# Altium project Airframe-Sensors.PrjPcb
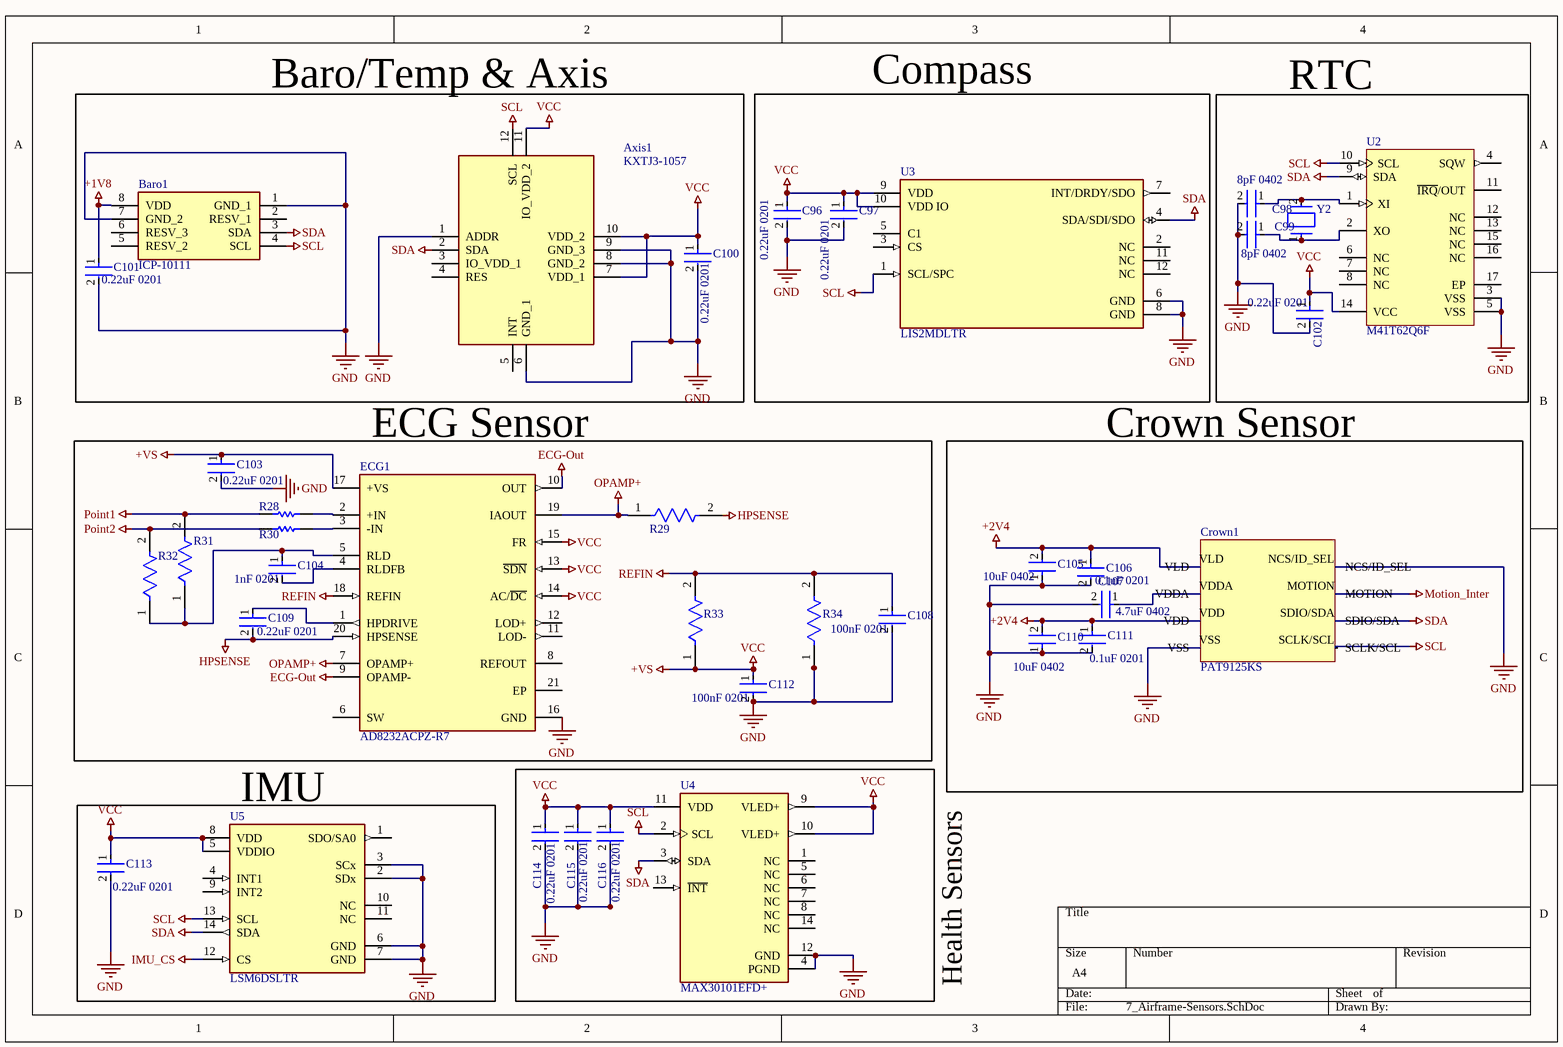
[diagram p0: 7_Airframe-Sensors.SchDoc]
1 sheet, 37 parts. Net scope: global (net labels, ports and power ports of the same name join across sheets).
Board file: Power_Test.PcbDoc

## Sheet 7_Airframe-Sensors.SchDoc
size A4; SheetNumber: 1; SheetTotal: 1

### Parts
Axis1  KXTJ3-1057  [2X2X0.9MMLGA]
Baro1  ICP-10111  [ICP10111]
C96  0.22uF 0201  [FP-C0603-030-0_03-IPC_C]
C97  0.22uF 0201  [FP-C0603-030-0_03-IPC_C]
C98  8pF 0402  [FP-C0402C225M9PACTU-MFG]
C99  8pF 0402  [FP-C0402C225M9PACTU-MFG]
C100  0.22uF 0201  [FP-C0603-030-0_03-IPC_C]
C101  0.22uF 0201  [FP-C0603-030-0_03-IPC_C]
C102  0.22uF 0201  [FP-C0603-030-0_03-IPC_C]
C103  0.22uF 0201  [FP-C0603-030-0_03-IPC_C]
C104  1nF 0201  [FP-C0603-030-0_03-IPC_C]
C105  10uF 0402  [FP-C0402C225M9PACTU-MFG]
C106  0.1uF 0201  [FP-C0603-030-0_03-IPC_C]
C107  4.7uF 0402  [FP-C0402C225M9PACTU-MFG]
C108  100nF 0201  [FP-C0603-030-0_03-IPC_C]
C109  0.22uF 0201  [FP-C0603-030-0_03-IPC_C]
C110  10uF 0402  [FP-C0402C225M9PACTU-MFG]
C111  0.1uF 0201  [FP-C0603-030-0_03-IPC_C]
C112  100nF 0201  [FP-C0603-030-0_03-IPC_C]
C113  0.22uF 0201  [FP-C0603-030-0_03-IPC_C]
C114  0.22uF 0201  [FP-C0603-030-0_03-IPC_C]
C115  0.22uF 0201  [FP-C0603-030-0_03-IPC_C]
C116  0.22uF 0201  [FP-C0603-030-0_03-IPC_C]
Crown1  PAT9125KS  [PAT9125KS-Footprint-1]
ECG1  AD8232ACPZ-R7  [FP-CP-20-8-IPC_C]
R28  RC0402FR-07180KL  [RESC1005X40X25ML05T10]  (value not drawn)
R29  CR0402-JW-105GLF  [FP-CR0402-MFG]  (value not drawn)
R30  RC0402FR-07180KL  [RESC1005X40X25ML05T10]  (value not drawn)
R31  CR0402-JW-105GLF  [FP-CR0402-MFG]  (value not drawn)
R32  CR0402-JW-105GLF  [FP-CR0402-MFG]  (value not drawn)
R33  CR0402-JW-105GLF  [FP-CR0402-MFG]  (value not drawn)
R34  CR0402-JW-105GLF  [FP-CR0402-MFG]  (value not drawn)
U2  M41T62Q6F  [STM-QFN-16_V]
U3  LIS2MDLTR  [FP-LGA-12-DM00170568-MFG]
U4  MAX30101EFD+  [FP-F143A5-1-MFG]
U5  LSM6DSLTR  [FP-LGA-14L-DM00249496-MFG]
Y2  ABS07-120-32.768KHZ-T  [FP-ABS07-120-MFG]  (value not drawn)

### Blocks framed on the sheet
ECG Sensor: C103 C104 C108 C109 C112 ECG1 R28-R34
Crown Sensor: C105-C107 C110 C111 Crown1
IMU: C113 U5

### Nets
+1V8: Baro1.8(VDD) C101.1
+2V4: C105.2 C106.1 C110.2 C111.1 Crown1.VDD Crown1.VLD
+VS: Axis1.7(VDD_1) Axis1.10(VDD_2) Axis1.11(IO_VDD_2) C96.1 C97.1 C100.1 C102.1 C103.1 C112.1 C113.1 C114.1 C115.1 C116.1 ECG1.13(~{SDN}) ECG1.14(AC/~{DC}) ECG1.15(FR) ECG1.17(+VS) R33.1 U2.14(VCC) U3.9(VDD) U3.10(VDD_IO) U4.9(VLED+) U4.10(VLED+) U4.11(VDD) U5.5(VDDIO) U5.8(VDD)  [also labelled VCC]
ECG-Out: ECG1.9(OPAMP-) ECG1.10(OUT)
GND: Axis1.1(ADDR) Axis1.6(GND_1) Axis1.8(GND_2) Axis1.9(GND_3) Baro1.1(GND_1) Baro1.7(GND_2) C96.2 C97.2 C98.2 C99.2 C100.2 C101.2 C102.2 C103.2 C105.1 C106.2 C107.2 C108.2 C110.1 C111.2 C112.2 C113.2 C114.2 C115.2 C116.2 Crown1.NCS/ID_SEL Crown1.VSS ECG1.16(GND) R34.1 U2.3(VSS) U2.5(VSS) U3.6(GND) U3.8(GND) U4.4(PGND) U4.12(GND) U5.2(SDx) U5.3(SCx) U5.6(GND) U5.7(GND)
HPSENSE: C109.2 ECG1.20(HPSENSE) R29.2
IMU_CS: U5.12(CS)
Motion_Inter: Crown1.MOTION
OPAMP+: ECG1.7(OPAMP+) ECG1.19(IAOUT) R29.1
Point1: R28.1 R31.2
Point2: R30.1 R32.2
REFIN: C108.1 ECG1.18(REFIN) R33.2 R34.2
SCL: Axis1.12(SCL) Baro1.4(SCL) Crown1.SCLK/SCL U2.10(SCL) U3.1(SCL/SPC) U4.2(SCL) U5.13(SCL)
SDA: Axis1.2(SDA) Baro1.3(SDA) Crown1.SDIO/SDA U2.9(SDA) U3.4(SDA/SDI/SDO) U4.3(SDA) U5.14(SDA)
NetC98_1: C98.1 U2.1(XI) Y2.2
NetC99_1: C99.1 U2.2(XO) Y2.1
NetC104_1: C104.1 ECG1.5(RLD) R31.1 R32.1
NetC104_2: C104.2 ECG1.4(RLDFB)
NetC107_1: C107.1 Crown1.VDDA
NetC109_1: C109.1 ECG1.1(HPDRIVE)
NetECG1_2: ECG1.2(+IN) R28.2
NetECG1_3: ECG1.3(-IN) R30.2

Not connected (* = marked no-connect by the designer): Axis1 3(IO_VDD_1) 4(RES) 5(INT); Baro1 2(RESV_1) 5(RESV_2) 6(RESV_3); ECG1 6(SW) 8(REFOUT) 11(LOD-) 12(LOD+) 21(EP); U2 4(SQW) 6(NC) 7(NC) 8(NC) 11(~{IRQ}/OUT) 12(NC) 13(NC) 15(NC) 16(NC) 17(EP); U3 2(NC) 3(CS) 5(C1) 7(INT/DRDY/SDO) 11(NC) 12(NC); U4 1(NC) 5(NC) 6(NC) 7(NC) 8(NC) 13(~{INT}) 14(NC); U5 1(SDO/SA0) 4(INT1) 9(INT2) 10(NC) 11(NC)

### Notes on the sheet
- Baro/Temp & Axis
- Compass
- RTC
- Health Sensors

### Library data of the parts
Axis1 = KXTJ3-1057: Accelerometer; Manufacturer_Name: Kionix; Datasheet Link: http://www.mouser.com/ds/2/348/KXTJ3-1057 Specifications Rev 2.0-1074602.pdf; Manufacturer_Part_Number: KXTJ3-1057; Mouser Part Number: 912-KXTJ3-1057; Mouser Price/Stock: https://www.mouser.co.uk/ProductDetail/Kionix/KXTJ3-1057?qs=hicmRmzGcNR8WipH%252BLEjqg%3D%3D
Baro1 = ICP-10111: Undefined or Miscellaneous; Manufacturer_Name: TDK; Datasheet Link: https://product.tdk.com/system/files/dam/doc/product/sensor/pressure/capacitive-pressure/data_sheet/ds-000186-icp-101xx.pdf; Height: 1mm; Manufacturer_Part_Number: ICP-10111; Mouser Part Number: 410-ICP-10111; Mouser Price/Stock: https://www.mouser.co.uk/ProductDetail/TDK-InvenSense/ICP-10111?qs=%252BEew9%252B0nqrBWGDChI3rokg%3D%3D; Arrow Part Number: ICP-10111; Arrow Price/Stock: https://www.arrow.com/en/products/icp-10111/invensense
C96 C97 C100-C104 C106 C108 C109 C111-C116 = CMP-08246-007095-1: Multilayer Ceramic Capacitors 220nF ±10% 6.3V X6S SMD 0201; Dielectric: X6S; Resistor Type: Ceramic; Length: 0.6mm; Capacitance: 220nF; Case Code (Metric): 0603; Series: C; Width: 0.012inch; Height: 0.3mm; Voltage Rating: 6.3V; Max Operating Temperature: 105°C; REACH SVHC: No SVHC; RoHS Compliant: Yes; Tolerance: 10%; Termination: SMD/SMT; Case/Package: 0201; Case Code (Imperial): 0201; Weight: 6E-06oz; Lead Free: Lead Free; Construction: Flat; Thickness: 300um; Mount: Surface Mount; Dielectric Material: Ceramic; Voltage Rating (DC): 6.3V; Packaging: Cut Tape; Package Quantity: 1; Min Operating Temperature: -55°C; Depth: 0.3mm
C98 C99 C105 C107 C110 = CMP-2008-02064-3: CAP CER 2.2UF 6.3V X5R 0402; Tolerance: 20%; Dissipation Factor: 5%; Dielectric Material: Ceramic; Lead Free: Lead Free; Depth: 0.5mm; Series: C; Termination: SMD/SMT; Case Code (Metric): 1005; Case/Package: 0402; Dielectric: X5R; RoHS Compliant: Yes; Thickness: 0.022inch; Voltage Rating: 6.3V; Voltage: 6.3V; Height: 0.5mm; Mount: Surface Mount; Construction: Flat; Case Code (Imperial): 0402; Min Operating Temperature: -55°C; Contact Plating: Tin; Radiation Hardening: No; Number of Pins: 2; Voltage Rating (DC): 6.3V; Capacitance: 2.2uF; Width: 0.5mm; Package Quantity: 1; Packaging: Tape and Reel; Max Operating Temperature: 85°C; Length: 1mm; REACH SVHC: No SVHC
Crown1 = CMP-00000-2
ECG1 = CMP-09085-000003-1: IC ECG FRONT END 20LFCSP; Input Offset Voltage (Vos): 3mV; Power Supply Rejection Ratio (PSRR): 90dB; Input Bias Current: 50pA; Nominal Supply Current: 170uA; Min Supply Voltage: 2V; Common Mode Rejection Ratio: 80dB; Max Supply Voltage: 3.5V; Contact Plating: Tin; Operating Supply Current: 170uA; Packaging: Tape and Reel; REACH SVHC: No SVHC; Case/Package: LFCSP EP; Number of Pins: 20; Lead Free: Contains Lead; Min Operating Temperature: -40°C; Package Quantity: 1500; Mount: Surface Mount; Max Operating Temperature: 85°C
R28 R30 = CMP-1011-00763-4: Chip Resistor, 180 KOhm, +/- 1%, 62.5 mW, -55 to 155 degC, 0402 (1005 Metric), RoHS, Tape and Reel; Manufacturer: Basic Passives; Power Rating: 62.5 mW; Voltage Rating: 50 V; Case\/Package: 0402; Length: 1 mm; RoHSCompliant: true; Mounting Technology: Surface Mount; Min Operating Temperature: -55 degC; PackageDescription: 2-Pin Surface Mount Device, Body 1 x 0.5 mm; Case Code (Imperial): 0402; Resistance: 180 KOhm; ComponentLink2URL: http://download.siliconexpert.com/pdfs/2016/1/13/0/45/27/830/yageo_/manual/8727809758379137pyu-rc_group_51_rohs_l___3.pdf; Packaging: Tape and Reel; Tolerance: 1%; Width: 0.5 mm; PackageReference: 0402; PartNumber: RC0402FR-07180KL; Max Operating Temperature: 155 degC; Package Quantity: 200; Height: 0.35 mm; Mount: Surface Mount; Pins: 2; DatasheetVersion: 12/2015; ComponentLink1URL: http://www.yageo.com/; ComponentLink1Description: Manufacturer URL; Case Code (Metric): 1005; REACH SVHC: No SVHC; ComponentLink2Description: Datasheet
R29 R31 R32 = CMP-2002-05525-2: Thick Film Chip Resistors 0402 1MΩ 0.0625W 5% 200ppm/°C; Voltage Rating: 50V; Max Power Dissipation: 63mW; Resistance: 1MR; Power Rating: 62.5mW; Case/Package: 0402; Depth: 0.5mm; Case Code (Imperial): 0402; Width: 0.02inch; Length: 1mm; Tolerance: 5%; Min Operating Temperature: -55°C; Number of Terminations: 2; Thickness: 356um; Case Code (Metric): 1005; Radiation Hardening: No; Height: 0.016inch; Military Standard: Not; Mount: Surface Mount; Termination: SMD/SMT; Composition: Thick Film; Temperature Coefficient: 200ppm/°C; Contact Plating: Tin; Packaging: Tape and Reel; Package Quantity: 10000; Max Operating Temperature: 125°C
R33 R34 = CMP-2002-05525-2: Thick Film Chip Resistors 0402 10MΩ 0.0625W 5% 200ppm/°C; Voltage Rating: 50V; Max Power Dissipation: 63mW; Resistance: 1MR; Power Rating: 62.5mW; Case/Package: 0402; Depth: 0.5mm; Case Code (Imperial): 0402; Width: 0.02inch; Length: 1mm; Tolerance: 5%; Min Operating Temperature: -55°C; Number of Terminations: 2; Thickness: 356um; Case Code (Metric): 1005; Radiation Hardening: No; Height: 0.016inch; Military Standard: Not; Mount: Surface Mount; Termination: SMD/SMT; Composition: Thick Film; Temperature Coefficient: 200ppm/°C; Contact Plating: Tin; Packaging: Tape and Reel; Package Quantity: 10000; Max Operating Temperature: 125°C
U2 = CMP-2000-06644-1: Low-Power Serial Real-Time Clock (RTC) with Alarm, 1.3 to 4.4 V, -40 to 85 degC, 16-Pin QFN, RoHS, Tape and Reel; Manufacturer: STMicroelectronics; Supply Voltage Max: 4.4V; Clock Frequency: 32.768kHz; Base Number: 41; No. of Outputs: 2; IC Interface Type: I2C,Serial; Memory Configuration: 16x8; Date Format: Day; RTC Features: Square-WaveOutput; Clock Format: HH:MM:SS; No. of Pins: 16; Supply Voltage Min: 1.3V; SVHC: NoSVHC(19-Dec-2012); Interface: Serial,I2C; Supply Voltage Range: 1.3Vto4.4V; Operating Temperature Min: -40°C; Type: RTC; Digital IC Case Style: QFN; Package Description: 16-Pin Quad Flat No-lead Package, Body 3 x 3 mm, Pitch 0.5 mm, Thermal Pad 1.8 x1.8 mm; Package Reference: QFN-16; Mounting Technology: SurfaceMount; Interface Type: I2C,Serial; Datasheet URL: http://www.st.com/content/ccc/resource/technical/document/datasheet/c8/66/38/71/c4/ac/49/9e/CD00019860.pdf/files/CD00019860.pdf/jcr:content/translations/en.CD00019860.pdf; Manufacturer URL: http://www.st.com/; Datasheet Version: Rev. 22, 10/2015; Clock IC Type: RTC; Termination Type: SMD; IC Case Style: QFN; Package / Case: QFN; Operating Temperature Range: -40°Cto+85°C; Operating Temperature Max: 85°C
U3 = CMP-12173-000002-1: SENSOR MR I2C/SPI 12LGA; Manufacturer: STMicroelectronics; Sensing Method: Magnetic; Min Supply Voltage: 1.71V; Sensor Output: I2C,SPI; Operating Supply Current: 50-200uA; Max Supply Voltage: 3.6V; Octopart: https://octopart.com/lis2mdltr-stmicroelectronics-81117311; RoHS: TRUE; Device Class L3: unset; Device Class L1: Sensors; ComponentLink2URL: https://www.st.com/resource/en/datasheet/lis2mdl.pdf; Automotive: No; Device Class L2: Magnetic Sensors; Lead Free: Yes; Temperature: -40°C to +85°C; Manufacturer Part Number: LIS2MDLTR; Temperature Range High: +85°C; Height: 0.7mm; Digikey Description: SENSOR MR I2C/SPI 12LGA; Category: IC; ComponentLink2Description: Datasheet; Package: LGA-12-DM00170568; Temperature Range Low: -40°C
U4 = CMP-05738-000001-1: INTEGRATED OPTICAL SENSOR; Manufacturer: Maxim Integrated; Max Supply Voltage: 2V; Max Junction Temp: +90°C; Operating Supply Current: 600uA; Min Supply Voltage: 1.7V; Sensor Output: I2C; RoHS: TRUE; Footprint Url: https://pdfserv.maximintegrated.com/land_patterns/90-0602.PDF; Manufacturer Part Number: MAX30101EFD+; Device Class L2: unset; Temperature Range Low: -40°C; Automotive: No; Height: 1.65mm; Temperature Range High: +85°C; ComponentLink2Description: Datasheet; Mouser Description: INTEGRATED OPTICAL SENSOR; ComponentLink2URL: https://datasheets.maximintegrated.com/en/ds/MAX30101.pdf; Octopart: https://octopart.com/max30101efd%2B-maxim+integrated-57054333; Temperature: -40°C to +85°C; Package: F143A5-1; Lead Free: Yes; Device Class L1: Sensors; Digikey Description: INTEGRATED OPTICAL SENSOR; Category: IC; Device Class L3: unset
U5 = CMP-2000-07467-2: IMU ACCEL/GYRO I2C/SPI 14LGA; Manufacturer: STMicroelectronics; Resolution: 16bits; Max Supply Voltage: 3.6V; Sensor Type: Temperature,Accelerometer,Gyroscope; Sensor Output: I2C,SPI; Gyro Range: 125/250/500/1000/2000°/s; Accel Range: 2/4/8/16g; Operating Supply Current: 0.29-0.65mA; Min Supply Voltage: 1.62V; Package: LGA-14L-DM00249496; Temperature Range High: +85°C; Automotive: No; Footprint Url: https://www.st.com/resource/en/technical_note/cd00134799.pdf; Height: 0.86mm; Device Class L1: Sensors; Octopart: https://octopart.com/lsm6dsltr-stmicroelectronics-66358193; Device Class L2: Motion Sensors; Lead Free: Yes; Category: IC; Device Class L3: Inertial Measurement Units (IMUs); ComponentLink2Description: Datasheet; RoHS: TRUE; ComponentLink2URL: https://www.st.com/resource/en/datasheet/lsm6dsl.pdf; Temperature Range Low: -40°C; Manufacturer Part Number: LSM6DSLTR; Mouser Description: iNEMO inertial module: always-on 3D accelerometer and 3D gyroscope; Digikey Description: IMU ACCEL/GYRO I2C/SPI 14LGA; Temperature: -40°C to +85°C
Y2 = CMP-2000-07587-2: CRYSTAL 32.7680KHZ 6PF SMD; Frequency Tolerance: 20ppm; Series Resistance: 60kR; ESR (Equivalent Series Resistance): 55kR; Depth: 1.5mm; Width: 0.061inch; Number of Pins: 2; Max Operating Temperature: 85°C; Length: 3.2mm; Case/Package: SMD/SMT; Series: ABS07; Lead Free: Lead Free; Min Operating Temperature: -40°C; Load Capacitance: 6pF; Packaging: Tape and Reel; Height: 0.035inch; Radiation Hardening: No; Tolerance: 20ppm; Operating Frequency: 32.768 kHz; Termination: SMD/SMT; REACH SVHC: No SVHC; RoHS Compliant: Yes; Frequency: 32.768kHz; Package Quantity: 3000; Mount: Surface Mount